# Altium schematic sheet Part07_NorFlash.SchDoc
size A4
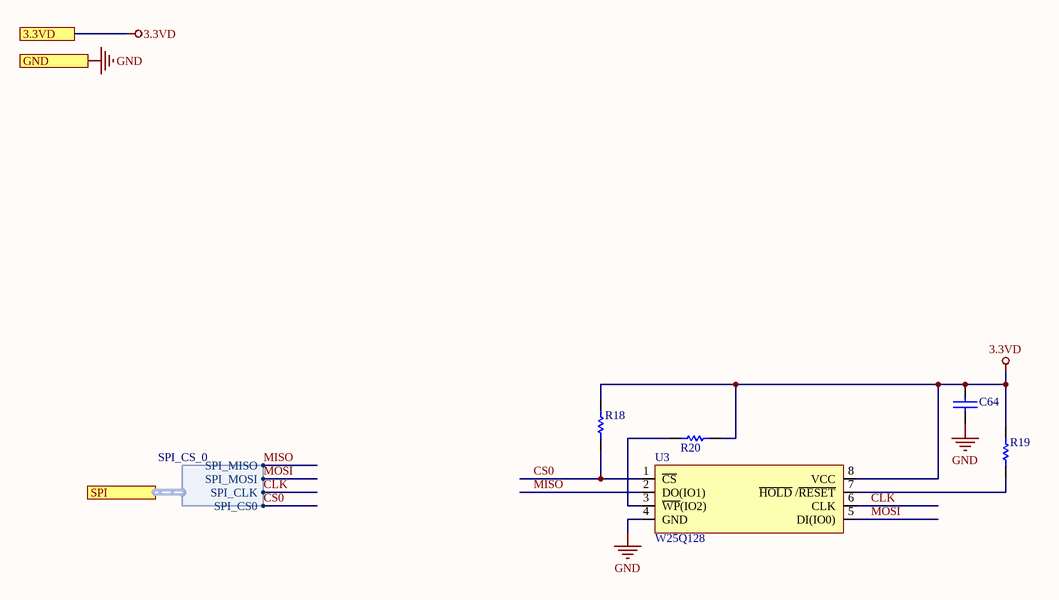
[diagram p0: Part07_NorFlash.SchDoc]

## Parts
C64  0.1uF/16V  [0402C]  (value not drawn)
R18  RES  [0402R]  (value not drawn)
R19  RES  [0402R]  (value not drawn)
R20  RES  [0402R]  (value not drawn)
U3  W25Q128  [SOP8]

## Ports
3.3VD, GND, SPI (harness SPI_CS_0)

## Harnesses
SPI_CS_0: SPI_MISO, SPI_MOSI, SPI_CLK, SPI_CS0

## Nets
3.3VD: C64.1 R18.1 R19.1 R20.2 U3.8(VCC) ; port 3.3VD
GND: C64.2 U3.4(GND) ; port GND
CLK: U3.6(CLK) ; port SPI.SPI_CLK
CS0: R18.2 U3.1(~{CS}) ; port SPI.SPI_CS0
MISO: U3.2(DO(IO1)) ; port SPI.SPI_MISO
MOSI: U3.5(DI(IO0)) ; port SPI.SPI_MOSI
NetR19_2: R19.2 U3.7(~{HOLD}_/~{RESET})
NetR20_1: R20.1 U3.3(~{WP}(IO2))

## Library data of the parts
C64 = CAP: 无极性电容